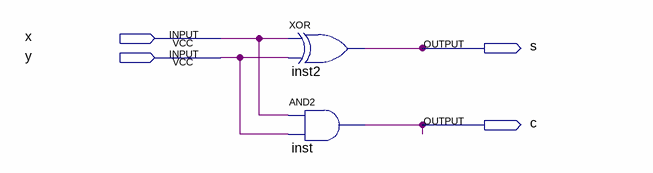
[diagram p0: schematic sheet]
// Quartus schematic half_adder.bdf as structural Verilog: 2 symbols, 4 pins
module half_adder (
  input  x,
  input  y,
  output s,
  output c
);

  xor inst2 (s, x, y);
  and inst (c, x, y);
endmodule
